# Altium project BoardA.PrjPcb (part 2 of 2)

## Sheet BoardA-USB.SchDoc
size A; SheetNumber: 2; SheetTotal: 2
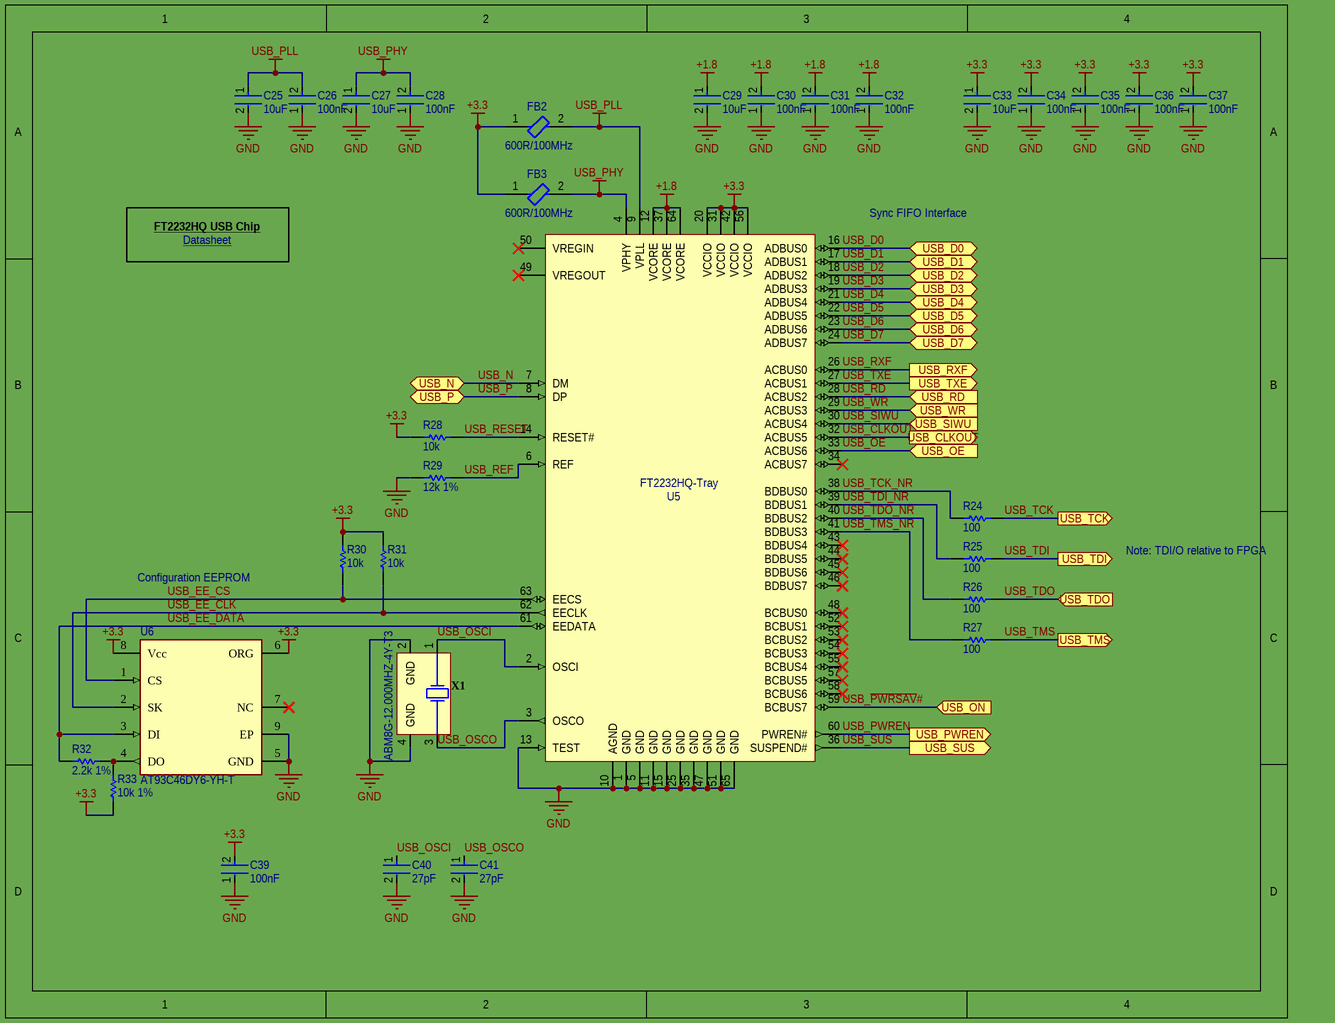
[diagram p2: BoardA-USB.SchDoc]

### Parts
C25  10uF  [FP-CL05A106MP5NUNC-IPC_C]
C26  100nF  [FP-GRM15-IPC_C]
C27  10uF  [FP-CL05A106MP5NUNC-IPC_C]
C28  100nF  [FP-GRM15-IPC_C]
C29  10uF  [FP-CL05A106MP5NUNC-IPC_C]
C30  100nF  [FP-GRM15-IPC_C]
C31  100nF  [FP-GRM15-IPC_C]
C32  100nF  [FP-GRM15-IPC_C]
C33  10uF  [FP-CL05A106MP5NUNC-IPC_C]
C34  100nF  [FP-GRM15-IPC_C]
C35  100nF  [FP-GRM15-IPC_C]
C36  100nF  [FP-GRM15-IPC_C]
C37  100nF  [FP-GRM15-IPC_C]
C39  100nF  [FP-GRM15-IPC_C]
C40  27pF  [FP-C0402-BB-MFG]
C41  27pF  [FP-C0402-BB-MFG]
FB2  600R/100MHz  [FP-BLM18-0_15-t0_8-MFG]
FB3  600R/100MHz  [FP-BLM18-0_15-t0_8-MFG]
R24  100  [RESC1005X40X25LL05T10]
R25  100  [RESC1005X40X25LL05T10]
R26  100  [RESC1005X40X25LL05T10]
R27  100  [RESC1005X40X25LL05T10]
R28  10k  [RESC1005X40X25LL05T05]
R29  12k 1%  [RESC1005X40X25LL05T05]
R30  10k  [RESC1005X40X25LL05T05]
R31  10k  [RESC1005X40X25LL05T05]
R32  2.2k 1%  [RESC1005X40X25NL05T10]
R33  10k 1%  [RESC1005X40X25LL05T05]
U5  FT2232HQ-Tray  [QFN64_2_N]
U6  AT93C46DY6-YH-T  [FP-C04-21355-Q4B-IPC_C]
X1  ABM8G-12.000MHZ-4Y-T3  [ABM8G-12.000MHZ-4Y-T3]

### Ports
USB_CLKOUT (out), USB_D0 (bidir), USB_D1 (bidir), USB_D2 (bidir), USB_D3 (bidir), USB_D4 (bidir), USB_D5 (bidir), USB_D6 (bidir), USB_D7 (bidir), USB_N (bidir), USB_OE (in), USB_ON (in), USB_P (bidir), USB_PWREN (out), USB_RD (in), USB_RXF (out), USB_SIWU (in), USB_SUS (out), USB_TCK (out), USB_TDI (out), USB_TDO (in), USB_TMS (out), USB_TXE (out), USB_WR (in)

### Nets
+1.8: C29.1 C30.2 C31.2 C32.2 U5.12(VCORE) U5.37(VCORE) U5.64(VCORE)
+3.3: C33.1 C34.2 C35.2 C36.2 C37.2 C39.2 FB2.1 FB3.1 R28.2 R30.2 R31.2 R33.1 U5.20(VCCIO) U5.31(VCCIO) U5.42(VCCIO) U5.56(VCCIO) U6.6(ORG) U6.8(Vcc)
GND: C25.2 C26.1 C27.2 C28.1 C29.2 C30.1 C31.1 C32.1 C33.2 C34.1 C35.1 C36.1 C37.1 C39.1 C40.2 C41.2 R29.1 U5.1(GND) U5.5(GND) U5.10(AGND) U5.11(GND) U5.13(TEST) U5.15(GND) U5.25(GND) U5.35(GND) U5.47(GND) U5.51(GND) U5.65(GND) U6.5(GND) U6.9(EP) X1.2(GND) X1.4(GND)
USB_PHY: C27.1 C28.2 FB3.2 U5.4(VPHY)
USB_PLL: C25.1 C26.2 FB2.2 U5.9(VPLL)
USB_CLKOUT: U5.32(ACBUS5) ; port USB_CLKOUT
USB_D0: U5.16(ADBUS0) ; port USB_D0
USB_D1: U5.17(ADBUS1) ; port USB_D1
USB_D2: U5.18(ADBUS2) ; port USB_D2
USB_D3: U5.19(ADBUS3) ; port USB_D3
USB_D4: U5.21(ADBUS4) ; port USB_D4
USB_D5: U5.22(ADBUS5) ; port USB_D5
USB_D6: U5.23(ADBUS6) ; port USB_D6
USB_D7: U5.24(ADBUS7) ; port USB_D7
USB_EE_CLK: R31.1 U5.62(EECLK) U6.2(SK)
USB_EE_CS: R30.1 U5.63(EECS) U6.1(CS)
USB_EE_DATA: R32.1 U5.61(EEDATA) U6.3(DI)
USB_N: U5.7(DM) ; port USB_N
USB_OE: U5.33(ACBUS6) ; port USB_OE
USB_OSCI: C40.1 U5.2(OSCI) X1.1
USB_OSCO: C41.1 U5.3(OSCO) X1.3
USB_P: U5.8(DP) ; port USB_P
USB_~{PWRSAV}#: U5.59(BCBUS7) ; port USB_ON  [project net USB_ON]
USB_PWREN: U5.60(PWREN#) ; port USB_PWREN
USB_RD: U5.28(ACBUS2) ; port USB_RD
USB_REF: R29.2 U5.6(REF)
USB_RESET: R28.1 U5.14(RESET#)
USB_RXF: U5.26(ACBUS0) ; port USB_RXF
USB_SIWU: U5.30(ACBUS4) ; port USB_SIWU
USB_SUS: U5.36(SUSPEND#) ; port USB_SUS
USB_TCK: R24.2 ; port USB_TCK
USB_TCK_NR: R24.1 U5.38(BDBUS0)
USB_TDI: R25.2 ; port USB_TDI
USB_TDI_NR: R25.1 U5.39(BDBUS1)
USB_TDO: R26.2 ; port USB_TDO
USB_TDO_NR: R26.1 U5.40(BDBUS2)
USB_TMS: R27.2 ; port USB_TMS
USB_TMS_NR: R27.1 U5.41(BDBUS3)
USB_TXE: U5.27(ACBUS1) ; port USB_TXE
USB_WR: U5.29(ACBUS3) ; port USB_WR
NetR32_2: R32.2 R33.2 U6.4(DO)

Not connected (* = marked no-connect by the designer): U5 34(ACBUS7)* 43(BDBUS4)* 44(BDBUS5)* 45(BDBUS6)* 46(BDBUS7)* 48(BCBUS0)* 49(VREGOUT)* 50(VREGIN)* 52(BCBUS1)* 53(BCBUS2)* 54(BCBUS3)* 55(BCBUS4)* 57(BCBUS5)* 58(BCBUS6)*; U6 7(NC)*

### Notes on the sheet
- FT2232HQ USB Chip
- Sync FIFO Interface
- Datasheet <https://www.ftdichip.com/Support/Documents/DataSheets/ICs/DS_FT2232H.pdf>
- Note: TDI/O relative to FPGA
- Configuration EEPROM

### Library data of the parts
C25 C27 C29 C33 = CMP-13271-000002-1: CAP CER 10UF 10V X5R 0402; Manufacturer Part Number: CL05A106MP5NUNC; Manufacturer: Samsung; Temperature Coefficient: 15%; Tolerance: 20%; Material: Ceramic; Octopart: https://octopart.com/cl05a106mp5nunc-samsung-22457395; Voltage Rating: 10V; RoHS: TRUE; Value: 10uF; Height: 0.7mm; Digikey Description: CAP CER 10UF 10V X5R 0402; Automotive: No; Package: CL05A106MP5NUNC; Device Class L1: Passive Components; Capacitance: 10uF; Temperature Range High: +85°C; ComponentLink2Description: Datasheet; Device Class L2: Capacitors; Temperature Characteristic: X5R; Temperature: -55°C to +85°C; ComponentLink2URL: http://www.samsungsem.com/kr/support/product-search/mlcc/__icsFiles/afieldfile/2019/05/10/19-CL05A106MP5NUNC.pdf; Device Class L3: Ceramic Capacitors; Category: Cap; Temperature Range Low: -55°C; Ipc Land Pattern Name: CAPC10050X50; Lead Free: Yes
C26 C28 C30-C32 C34-C37 C39 = CMP-2100-03641-2: CAP CER 0.1UF 16V X7R 0402; Manufacturer Part Number: GRM155R71C104KA88D; Manufacturer: Murata; Standoff Height: 0mm; Tolerance: 10%; Voltage Rating: 16Vdc; Material: Ceramic; Capacitance: 0.10μF; Value: 0.10μF; RoHS: TRUE; Temperature Characteristic: X7R; Octopart: https://octopart.com/grm155r71c104ka88d-murata-196880; Digikey Description: CAP CER 0.1UF 16V X7R 0402; Device Class L3: Ceramic Capacitors; Height: 0.55mm; ComponentLink2Description: Datasheet; Temperature Range Low: -55°C; Ipc Land Pattern Name: CAPC10050X219; ComponentLink2URL: https://search.murata.co.jp/Ceramy/image/img/A01X/G101/ENG/GRM155R71H471KA01-01A.pdf; Device Class L1: Passive Components; Lead Free: yes; Category: Cap; Package: GRM15; Temperature: -55°C to +125°C; Device Class L2: Capacitors; Temperature Range High: +125°C; Mouser Description: 0402 0.1 uF 16V ±10 % Tolerance X7R SMT Multilayer Ceramic Capacitor
C40 C41 = CMP-1034-00963-6: CAP CER 27PF 50V C0G/NP0 0402; Manufacturer: Kemet; Manufacturer Part Number: C0402C270J5GACTU; Temperature Coefficient: 15%; Tolerance: 0.05; Temperature Characteristic: C0G; Material: Ceramic; Device Class L1: Passive Components; Device Class L3: Ceramic Capacitors; RoHS: TRUE; Height: 0.55mm; Value: 27 pF; Device Class L2: Capacitors; Capacitance: 27 pF; Automotive: No; Octopart: https://octopart.com/c0402c270j5gactu-kemet-149444; Temperature: -55°C to +125°C; Temperature Range Low: -55°C; Package: C0402-BB; Ipc Land Pattern Name: CAPC10050X50; Category: Cap; Lead Free: Yes; Temperature Range High: +125°C; ComponentLink2URL: https://content.kemet.com/datasheets/KEM_C1002_X7R_SMD.pdf; ComponentLink2Description: Datasheet; Mouser Description: Multilayer Ceramic Capacitor, C Series, 27 pF, - 5%, C0G / NP0, 50 V, 0402 [1005 Metric]; Digikey Description: CAP CER 27PF 50V C0G/NP0 0402; Voltage Rating: 50 V
FB2 FB3 = CMP-0686-00436-3: Chip Ferrite Bead, 0603, 600Ω @ 100MHz, 0.38Ω, 25%, 500mA; Number of Lines: 1; Impedance: 600R; DC Resistance (DCR): 380mR; Material: Steel; Shielding: Unshielded; Max DC Current: 500mA; Termination: SMD/SMT; Military Standard: Not; Number of Circuits: 1; Min Operating Temperature: -55°C; Case Code (Imperial): 0603; Width: 0.8mm; Current Rating: 500mA; Lead Free: Lead Free; Packaging: Tape and Reel; Frequency: 100MHz; Max Operating Temperature: 125°C; DC Current: 500mA; REACH SVHC: No SVHC; Case/Package: 0603; Package Quantity: 1; Height: 0.8mm; Number of Pins: 2; Depth: 0.8mm; Test Frequency: 100MHz; Case Code (Metric): 1608; Tolerance: 25%; Core Material: Ferrite; Weight: 7.1E-05oz; Max Current Rating: 500mA; Radiation Hardening: No; Length: 1.6mm; RoHS Compliant: Yes
R24-R27 = CMP-2002-07344-1: Part Number: RC0402FR-07100RL; Manufacturer: Yageo / Phycomp
R28 R30 R31 R33 = CMP-2000-07588-1: Chip Resistor, 10 KOhm, +/- 1%, 0.1 W, -55 to 155 degC, 0402 (1005 Metric), RoHS, Tape and Reel; Manufacturer: Panasonic; Power Rating: 100mW; Voltage Rating: 50V; Resistance: 10KOhm; Case\/Package: 0402; Temperature Coefficient: 100ppm\/degreesC; RoHSCompliant: True; Lead Free: LeadFree; Package Quantity: 1; Contact Plating: Tin; Length: 1mm; Radiation Hardening: No; REACH SVHC: NoSVHC; Max Operating Temperature: 155degC; Depth: 0.5mm; Case Code (Imperial): 0402; Military Standard: Not; Package Description: 2-Pin Surface Mount Device, Body 1 x 0.5 mm; Termination: SMD/SMT; Case Code (Metric): 1005; Height: 0.35mm; Packaging: TapeandReel; Voltage Rating (DC): 50V; Package Reference: 402; Number of Pins: 2; Tolerance: 1%; Mounting Technology: SurfaceMount; Width: 0.02inch; Mount: SurfaceMount; Datasheet URL: https://industrial.panasonic.com/cdbs/www-data/pdf/RDA0000/AOA0000C304.pdf; Composition: ThickFilm; Datasheet Version: 02/2017; Manufacturer URL: http://www.panasonic.com/; Max Power Dissipation: 100mW; Number of Terminations: 2; Min Operating Temperature: -55degC
R29 = CMP-2002-00646-4: Chip Resistor, 12 KOhm, +/- 1%, 0.1 W, -55 to 155 degC, 0402 (1005 Metric), RoHS, Tape and Reel; PartNumber: ERJ-2RKF1202X; Resistance: 12 KOhm; Voltage Rating: 50 V; Case\/Package: 0402; Power Rating: 100 mW; Length: 1 mm; PackageReference: 0402; DatasheetVersion: 04/2015; ComponentLink2Description: Datasheet; ComponentLink1URL: http://www.panasonic.com/; Pins: 2; Width: 0.5 mm; REACH SVHC: Yes; Packaging: Tape and Reel; Min Operating Temperature: -55 degC; Mounting Technology: Surface Mount; Max Operating Temperature: 155 degC; Case Code (Imperial): 0402; Height: 0.35 mm; Tolerance: 1%; PackageDescription: 2-Pin Surface Mount Device, Body 1 x 0.5 mm; RoHSCompliant: true; ComponentLink1Description: Manufacturer URL; Mount: Surface Mount; ComponentLink2URL: http://industrial.panasonic.com/cdbs/www-data/pdf/RDA0000/AOA0000C86.pdf; Package Quantity: 10000; Case Code (Metric): 1005
R32 = CMP-2002-07567-1: Manufacturer: Yageo / Phycomp; Part Number: RC0402FR-072K2L
U5 = CMP-0078-00003-3: Dual High Speed USB To Multipurpose UART/FIFO IC, 64-pin QFN, Tray; Manufacturer: FTDI; PackageVersion: Jun-12; ComponentLink2URL: http://www.ftdichip.com/Support/Documents/DataSheets/ICs/DS_FT2232H.pdf; ComponentLink1Description: Manufacturer URL; RevisionNote: DatasheetVersion updated to 2.21 Jun-2012; PackageReference: QFN64_2; PackageDescription: 64-Pin Quad Flat No-Lead, 9 x 9 mm Body, 0.5 mm Pitch, 4.35 x 4.35 mm Exposed Pad; ComponentLink2Description: Datasheet; ComponentLink1URL: http://www.ftdichip.com/; PartNumber: FT2232HQ-Tray; DatasheetVersion: ver 2.21, Jun-2012
U6 = CMP-06313-000080-1: IC EEPROM 1KBIT SPI 8MINI MAP; Frequency: 2MHz; Memory Type: Non-Volatile; Memory Size: 1Kb; Max Operating Temperature: 85°C; RoHS Compliant: Yes; Packaging: Tape and Reel; Min Operating Temperature: -40°C; Mount: Surface Mount
X1 = ABM8G-12.000MHZ-4Y-T3: ABRACON - ABM8G-12.000MHZ-4Y-T3 - CRYSTAL, 12MHZ, 10PF, 3.2 X 2.5MM; ESR (Equivalent Series Resistance): 120R; Frequency Tolerance: 30ppm; Supplier 1: Digi-Key; RoHS: Yes; Stock 1: 11481; Pricing 1: 1=0.67000, 10=0.59600, 50=0.55720, 100=0.49250, 500=0.46656, 1000=0.38880 (USD); Mount: Surface Mount; Case/Package: CSMD; Number of Pins: 4; Min Operating Temperature: -10°C; Max Operating Temperature: 60°C; Frequency: 12MHz; Load Capacitance: 10pF; Packaging: Tape and Reel; Frequency Stability: 30ppm; Series: ABM8G; Series Resistance: 120R; Operating Frequency: 12 MHz; Length: 3.2mm; Width: 0.098inch; Height: 0.039inch; Depth: 2.5mm; REACH SVHC: No SVHC; Lead Free: Lead Free; ComponentLink1URL: https://datasheet.ciiva.com/15116/getdatasheetpartid-719872-15116768.pdf?src-supplier=Verical; ComponentLink1Description: https://datasheet.ciiva.com/15116/getdatasheetpartid-719872-15116768.pdf?src-supplier=Verical; ComponentLink2URL: https://datasheet.ciiva.com/857/abm8g-857959.pdf?src-supplier=Digi-Key; ComponentLink2Description: https://datasheet.ciiva.com/857/abm8g-857959.pdf?src-supplier=Digi-Key; ComponentLink3URL: https://datasheet.ciiva.com/857/abm8g-857960.pdf?src-supplier=Digi-Key; ComponentLink3Description: https://datasheet.ciiva.com/857/abm8g-857960.pdf?src-supplier=Digi-Key; ComponentLink4URL: https://datasheet.ciiva.com/857/abm8g-857961.pdf?src-supplier=Digi-Key; ComponentLink4Description: https://datasheet.ciiva.com/857/abm8g-857961.pdf?src-supplier=Digi-Key; ComponentLink5URL: https://datasheet.ciiva.com/16216/abm8g-16216655.pdf?src-supplier=Future+Electronics; ComponentLink5Description: https://datasheet.ciiva.com/16216/abm8g-16216655.pdf?src-supplier=Future+Electronics; Manufacturer Part Number: ABM8G-12.000MHZ-4Y-T3; Manufacturer: Abracon; Supplier Part Number 1: 535-10901-1-ND; Category: Crystals

## Nets that join several sheets
+1.8: BoardA (5 pins), BoardA-USB (7 pins)
+3.3: BoardA (7 pins), BoardA-USB (18 pins)
GND: BoardA (73 pins), BoardA-USB (32 pins)
USB_CLKOUT: BoardA (J2.36), BoardA-USB (U5.32)
USB_D0: BoardA (J2.50), BoardA-USB (U5.16)
USB_D1: BoardA (J2.49), BoardA-USB (U5.17)
USB_D2: BoardA (J2.48), BoardA-USB (U5.18)
USB_D3: BoardA (J2.47), BoardA-USB (U5.19)
USB_D4: BoardA (J2.46), BoardA-USB (U5.21)
USB_D5: BoardA (J2.45), BoardA-USB (U5.22)
USB_D6: BoardA (J2.44), BoardA-USB (U5.23)
USB_D7: BoardA (J2.43), BoardA-USB (U5.24)
USB_N: BoardA (D3.2 J1.A7 J1.B7), BoardA-USB (U5.7)
USB_OE: BoardA (J2.35), BoardA-USB (U5.33)
USB_ON: BoardA (R5.1 R6.2), BoardA-USB (U5.59)
USB_P: BoardA (D3.3 J1.A6 J1.B6), BoardA-USB (U5.8)
USB_PWREN: BoardA (J2.17), BoardA-USB (U5.60)
USB_RD: BoardA (J2.39), BoardA-USB (U5.28)
USB_RXF: BoardA (J2.41), BoardA-USB (U5.26)
USB_SIWU: BoardA (J2.37), BoardA-USB (U5.30)
USB_SUS: BoardA (J2.18), BoardA-USB (U5.36)
USB_TCK: BoardA (J2.33), BoardA-USB (R24.2)
USB_TDI: BoardA (J2.32), BoardA-USB (R25.2)
USB_TDO: BoardA (J2.31), BoardA-USB (R26.2)
USB_TMS: BoardA (J2.30), BoardA-USB (R27.2)
USB_TXE: BoardA (J2.40), BoardA-USB (U5.27)
USB_WR: BoardA (J2.38), BoardA-USB (U5.29)